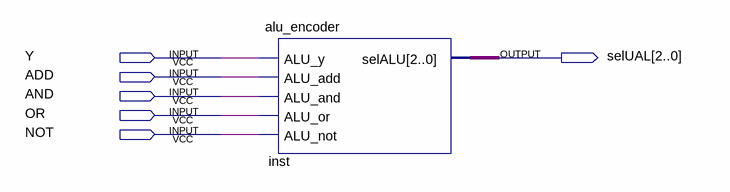
[diagram p0: schematic sheet]
// Quartus schematic test.bdf as structural Verilog: 1 symbols, 6 pins
module test (
  input  Y,
  input  ADD,
  input  AND,
  input  OR,
  input  NOT,
  output [2:0] selUAL
);

  alu_encoder inst (.ALU_y(Y), .ALU_add(ADD), .ALU_and(AND), .ALU_or(OR), .ALU_not(NOT), .selALU(selUAL));
endmodule
